# EAGLE design electronics_board (EAGLE 9.6.2)
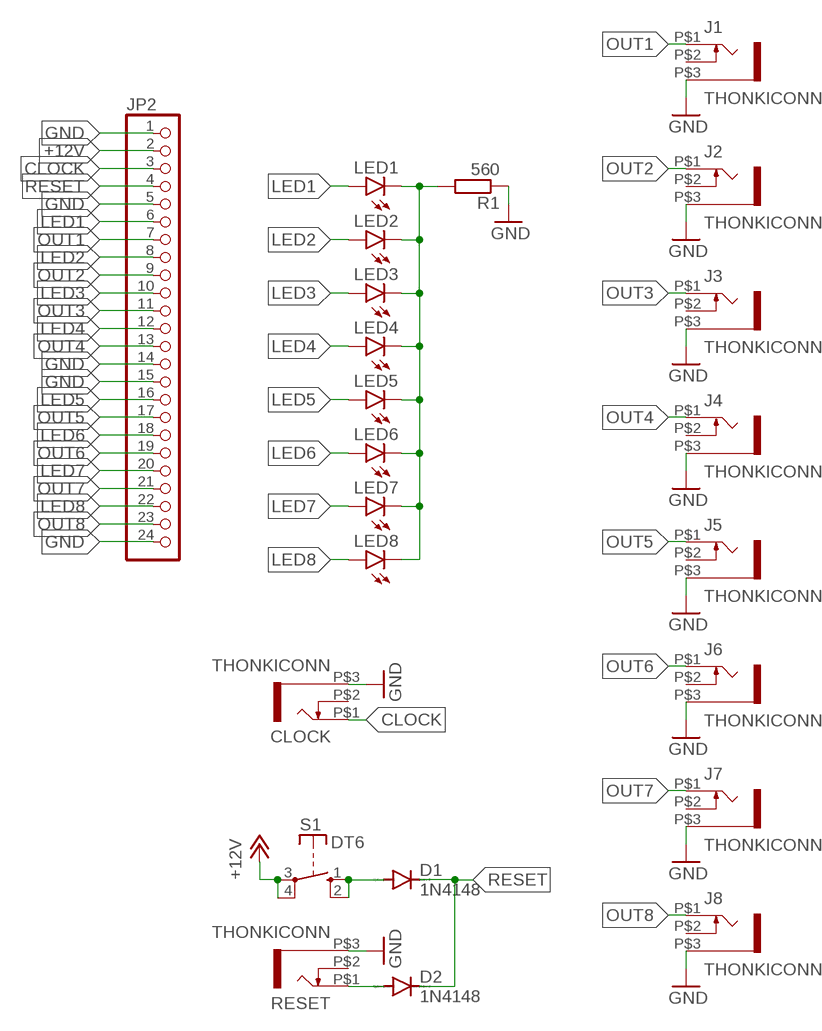
[diagram p0: schematic, sheet 1]

## Parts
CLOCK  THONKICONN  WQP-PJ301M-12_JACK  [WQP-PJ301M-12_JACK]
D1  1N4148  1N4148DO35-7  [DO35-7]
D2  1N4148  1N4148DO35-7  [DO35-7]
J1  THONKICONN  WQP-PJ301M-12_JACK  [WQP-PJ301M-12_JACK]
J2  THONKICONN  WQP-PJ301M-12_JACK  [WQP-PJ301M-12_JACK]
J3  THONKICONN  WQP-PJ301M-12_JACK  [WQP-PJ301M-12_JACK]
J4  THONKICONN  WQP-PJ301M-12_JACK  [WQP-PJ301M-12_JACK]
J5  THONKICONN  WQP-PJ301M-12_JACK  [WQP-PJ301M-12_JACK]
J6  THONKICONN  WQP-PJ301M-12_JACK  [WQP-PJ301M-12_JACK]
J7  THONKICONN  WQP-PJ301M-12_JACK  [WQP-PJ301M-12_JACK]
J8  THONKICONN  WQP-PJ301M-12_JACK  [WQP-PJ301M-12_JACK]
JP2  PINHD-1X24  [1X24]
LED1  LED  [LED_3MM]
LED2  LED  [LED_3MM]
LED3  LED  [LED_3MM]
LED4  LED  [LED_3MM]
LED5  LED  [LED_3MM]
LED6  LED  [LED_3MM]
LED7  LED  [LED_3MM]
LED8  LED  [LED_3MM]
R1  560  R-EU_0204/5  [0204/5]
RESET  THONKICONN  WQP-PJ301M-12_JACK  [WQP-PJ301M-12_JACK]
S1  DT6  [DT6]

## Nets
+12V: JP2.2 S1.3(P) S1.4(P)
CLOCK: CLOCK.P$1 JP2.3
GND: CLOCK.P$3 J1.P$3 J2.P$3 J3.P$3 J4.P$3 J5.P$3 J6.P$3 J7.P$3 J8.P$3 JP2.1 JP2.5 JP2.14 JP2.15 JP2.24 R1.1 RESET.P$3
LED1: JP2.6 LED1.A
LED2: JP2.8 LED2.A
LED3: JP2.10 LED3.A
LED4: JP2.12 LED4.A
LED5: JP2.16 LED5.A
LED6: JP2.18 LED6.A
LED7: JP2.20 LED7.A
LED8: JP2.22 LED8.A
N$1: LED1.K(C) LED2.K(C) LED3.K(C) LED4.K(C) LED5.K(C) LED6.K(C) LED7.K(C) LED8.K(C) R1.2
N$2: D1.A S1.1(S) S1.2(S)
N$5: D2.A RESET.P$1
OUT1: J1.P$1 JP2.7
OUT2: J2.P$1 JP2.9
OUT3: J3.P$1 JP2.11
OUT4: J4.P$1 JP2.13
OUT5: J5.P$1 JP2.17
OUT6: J6.P$1 JP2.19
OUT7: J7.P$1 JP2.21
OUT8: J8.P$1 JP2.23
RESET: D1.C D2.C JP2.4
Unconnected: CLOCK.P$2 J1.P$2 J2.P$2 J3.P$2 J4.P$2 J5.P$2 J6.P$2 J7.P$2 J8.P$2 RESET.P$2

## Library data of the parts
CLOCK J1-J8 RESET = thonkiconn:WQP-PJ301M-12_JACK; OC_FARNELL: unknown
D1 D2 = diode:1N4148: DIODE high speed (Philips)
JP2 = pinhead:PINHD-1X24: PIN HEADER
LED1-LED8 = nagasaki45:LED: 3mm through hole LED; MF: BROADCOM; MPN: HLMP-1700; OC_FARNELL: 1003207
R1 = rcl:R-EU_: RESISTOR, European symbol; MF: MULTICOMP PRO; MPN: MCF 0.25W 560R; OC_FARNELL: 9339590; SPICEPREFIX: R
S1 = switch-misc:DT: ITT SWITCH

## Net classes
1 power: width 0.406 mm
2 ground: width 0.406 mm

## Board
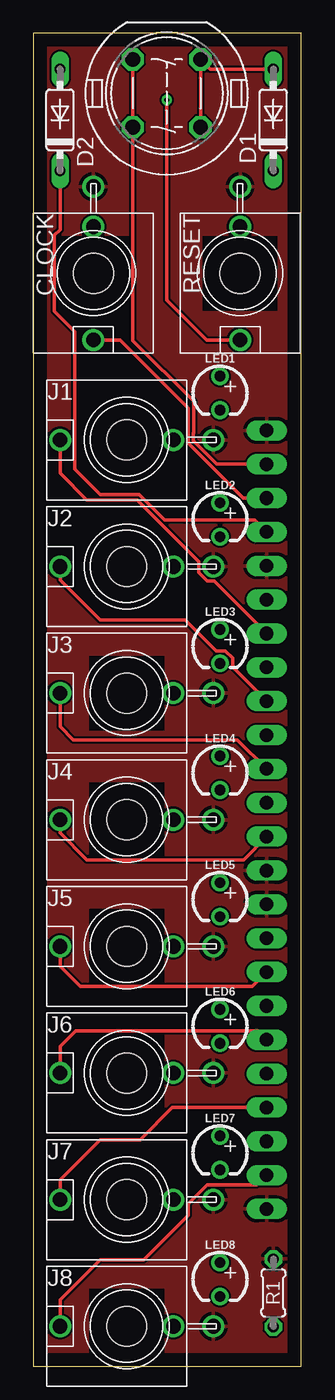
[diagram p1: board, top side]
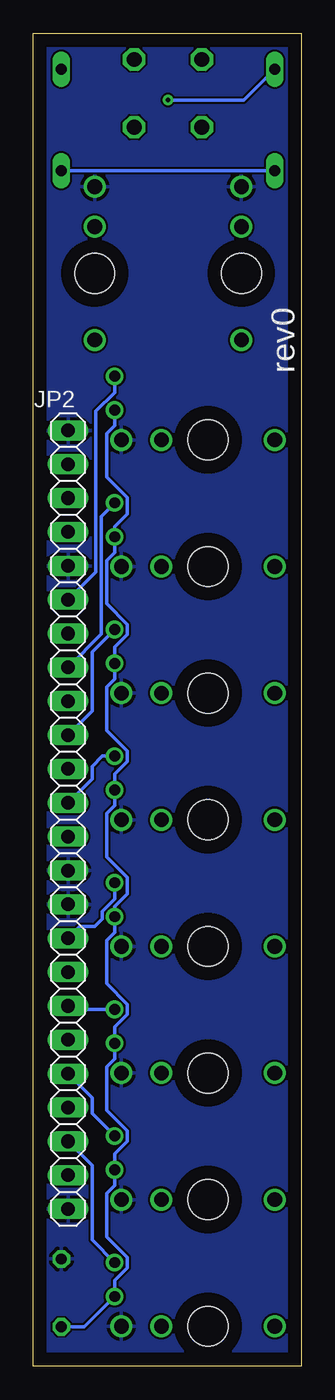
[diagram p2: board, bottom side, seen from below]

Size 20.1 x 100 mm. Coordinates in mm from the lower left corner, seen from the top.
Outline: 0,0 20.1,0 20.1,100 0,100 0,0
Copper layers (1*16): Top 0.035mm / dielectric 1.5mm / Bottom 0.035mm
Design rules "default *": minimum track width 6mil, minimum drill 0.35mm, track to track 6mil, track to pad 6mil, pad to pad 6mil, via to via 6mil, smd to smd 6mil, copper to edge 40mil, drill to drill 6mil, minimum pad ring 10mil, minimum via ring 8mil, stop-mask expansion 4mil, vias tented up to drill 0mil, thermal gap 10mil
Holes 3 mm at 7,69.5 7,60 7,50.5 7,41 7,31.5 7,22 7,12.5 7,3 4.5,82 15.5,82

### Footprints (pad centres in the part's own frame; a part is rotated, then mirrored left to right if it is on the bottom)
WQP-PJ301M-12_JACK = drill 1.1: P$1 0,5; P$2 0,-3.5; P$3 0,-6.5
DO35-7 = drill 0.813 long: A 3.81,0; C -3.81,0
1X24 = drill 1.016 long: 1 -29.21,0; 2 -26.67,0; 3 -24.13,0; 4 -21.59,0; 5 -19.05,0; 6 -16.51,0; 7 -13.97,0; 8 -11.43,0; 9 -8.89,0; 10 -6.35,0; 11 -3.81,0; 12 -1.27,0; 13 1.27,0; 14 3.81,0; 15 6.35,0; 16 8.89,0; 17 11.43,0; 18 13.97,0; 19 16.51,0; 20 19.05,0; 21 21.59,0; 22 24.13,0; 23 26.67,0; 24 29.21,0
LED_3MM = drill 0.813: A -1.27,0; K 1.27,0
0204/5 = drill 0.813 octagon: 1 -2.54,0; 2 2.54,0
DT6 = drill 1.118 octagon: 1 -2.54,2.54; 2 2.54,2.54; 3 2.54,-2.54; 4 -2.54,-2.54

### Placement (x,y rotation side)
CLOCK  4.5,82 180 top
D1  18,93.5 90 top
D2  2,93.5 90 top
J1  7,69.5 90 top
J2  7,60 90 top
J3  7,50.5 90 top
J4  7,41 90 top
J5  7,31.5 90 top
J6  7,22 90 top
J7  7,12.5 90 top
J8  7,3 90 top
JP2  17.5,41 270 bottom
LED1  14,73 270 top
LED2  14,63.5 270 top
LED3  14,54 270 top
LED4  14,44.5 270 top
LED5  14,35 270 top
LED6  14,25.5 270 top
LED7  14,16 270 top
LED8  14,6.5 270 top
R1  18,5.5 270 top
RESET  15.5,82 180 top
S1  10,95.5 270 top

### Tracks (layer width: path | path; a pad name or v marks a point on that pad's centre or on a via)
+12V
  Top 0.254: S1.4 S1.3 7.46,76.94 12.01,72.39 12.01,70 12.01,69.43 13.77,67.67 JP2.2
CLOCK
  Top 0.254: JP2.3 15.73,65.13 11.6,69.26 11.6,71.9 6.5,77 CLOCK.P$1
GND
  pour Top: -1,101 -1,-1 21,-1 21,101
  pour Bottom: -1,101 -1,-1 21,-1 21,101
LED1
  Bottom 0.254: JP2.6 15.42,59.59 15.42,71.64 14,73.06 LED1.A
LED2
  Bottom 0.254: LED2.A 15.01,63.76 15.01,57.03 15,57.02 15,54.93 JP2.8
LED3
  Bottom 0.254: JP2.10 15.7,49.15 15.7,53.57 LED3.A
LED4
  Bottom 0.254: JP2.12 15.7,44.07 15.7,45 14.93,45.77 LED4.A
LED5
  Bottom 0.254: JP2.16 16.61,33 15.5,33 14.94,33.56 14.94,34.12 14,35.06 LED5.A
LED6
  Bottom 0.254: JP2.18 17.24,26.77 LED6.A
LED7
  Bottom 0.254: JP2.20 15.7,20.15 15.7,18.97 LED7.A
LED8
  Bottom 0.254: JP2.22 15.7,15.07 15.7,9.47 LED8.A
N$1
  Bottom 0.254: R1.2 16.27,2.96 LED8.K 14,6.44 13.06,7.38 13.06,8.16 14.6,9.7 14.6,12.96 14,13.56 LED7.K 14,15.94 13.06,16.88 13.06,17.66 14.6,19.2 14.6,22.46 14,23.06 LED6.K 14,25.44 13.06,26.38 13.06,27.16 14.6,28.7 14.6,31.96 14,32.56 LED5.K 14,34.48 13.06,35.42 13.06,36.66 14.6,38.2 14.6,41.46 14,42.06 LED4.K 14,44.44 13.06,45.38 13.06,46.16 14.6,47.7 14.6,50.96 14,51.56 LED3.K 14,53.94 13.06,54.88 13.06,55.66 14.6,57.2 14.6,60.46 14,61.06 LED2.K 14,62.98 13.06,63.92 13.06,65.16 14.6,66.7 14.6,69.96 14,70.56 LED1.K
N$2
  Top 0.254: S1.2 S1.1 13.27,97.31 D1.A
N$5  (via drill 0.35)
  Top 0.254: v10,95 10,80 13,77 RESET.P$1
  Bottom 0.254: D2.A 4.31,95 v10,95
OUT1
  Top 0.254: JP2.7 13.57,58.9 13.04,58.9 12.4,59.54 12.4,60.38 7.78,65 4,65 2,67 J1.P$1
OUT2
  Top 0.254: JP2.9 14.94,52.45 14.94,53.12 14.39,53.67 13.72,53.67 11.39,56 5,56 2,59 J2.P$1
OUT3
  Top 0.254: JP2.11 15.31,47 3,47 2,48 J3.P$1
OUT4
  Top 0.254: JP2.13 15.77,38 4,38 2,40 J4.P$1
OUT5
  Top 0.254: JP2.17 16.43,28.5 3.5,28.5 2,30 J5.P$1
OUT6
  Top 0.254: J6.P$1 2,24 3.17,25.17 16.82,25.17 JP2.19
OUT7
  Top 0.254: JP2.21 10.41,19.41 8,17 5,17 2,14 J7.P$1
OUT8
  Top 0.254: J8.P$1 2,5 5,8 8.28,8 11.6,11.32 11.6,12.17 13.04,13.6 16.77,13.6 JP2.23
RESET
  Top 0.254: JP2.4 16.59,63.5 9.85,63.5 7.95,65.41 5,65.41 3.1,67.3 3.1,77.62 1.57,79.15 1.57,84.85 2,85.28 D2.C
  Bottom 0.254: D2.C D1.C

### Text on the board
bPlace: rev0